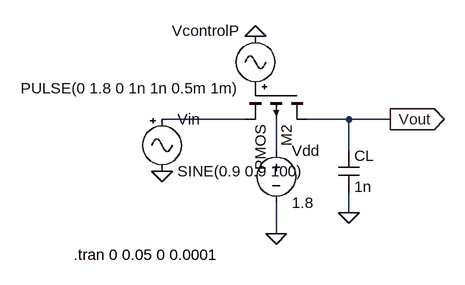
[diagram p0: schematic Lab 7 Fig 1b.asc]
Lab 7 Fig 1b.asc, the LTspice schematic file:
Version 4
SHEET 1 880 680
WIRE 16 176 -112 176
WIRE 176 176 112 176
WIRE 240 176 176 176
WIRE 64 224 64 176
WIRE 176 224 176 176
WIRE 176 320 176 288
WIRE 64 352 64 304
FLAG 240 176 Vout
IOPIN 240 176 Out
FLAG 176 320 0
FLAG 64 352 0
FLAG -112 256 0
FLAG 32 48 0
SYMBOL cap 160 224 R0
SYMATTR InstName CL
SYMATTR Value 1n
SYMBOL Misc\\signal -112 160 R0
WINDOW 123 0 0 Left 0
WINDOW 39 0 0 Left 0
SYMATTR InstName Vin
SYMATTR Value SINE(0.9 0.9 100)
SYMBOL voltage 64 208 R0
SYMATTR InstName Vdd
SYMATTR Value 1.8
SYMBOL Misc\\signal 32 144 R180
WINDOW 0 24 104 Left 2
WINDOW 3 24 16 Left 2
SYMATTR InstName VcontrolP
SYMATTR Value PULSE(0 1.8 0 1n 1n 0.5m 1m)
SYMBOL pmos4 112 128 R90
SYMATTR InstName M2
SYMATTR Value2 l=1u w=100u
TEXT -248 384 Left 2 !.tran 0 0.05 0 0.0001

The netlist it stands for:
* Lab 7 Fig 1b.asc
CL Vout 0 1n
Vin N001 0 SINE(0.9 0.9 100)
Vdd N002 0 1.8
VcontrolP P001 0 PULSE(0 1.8 0 1n 1n 0.5m 1m)
M2 Vout P001 N001 N002 PMOS l=1u w=100u
.model NMOS NMOS
.model PMOS PMOS
.lib standard.mos
.tran 0 0.05 0 0.0001
.backanno
.end